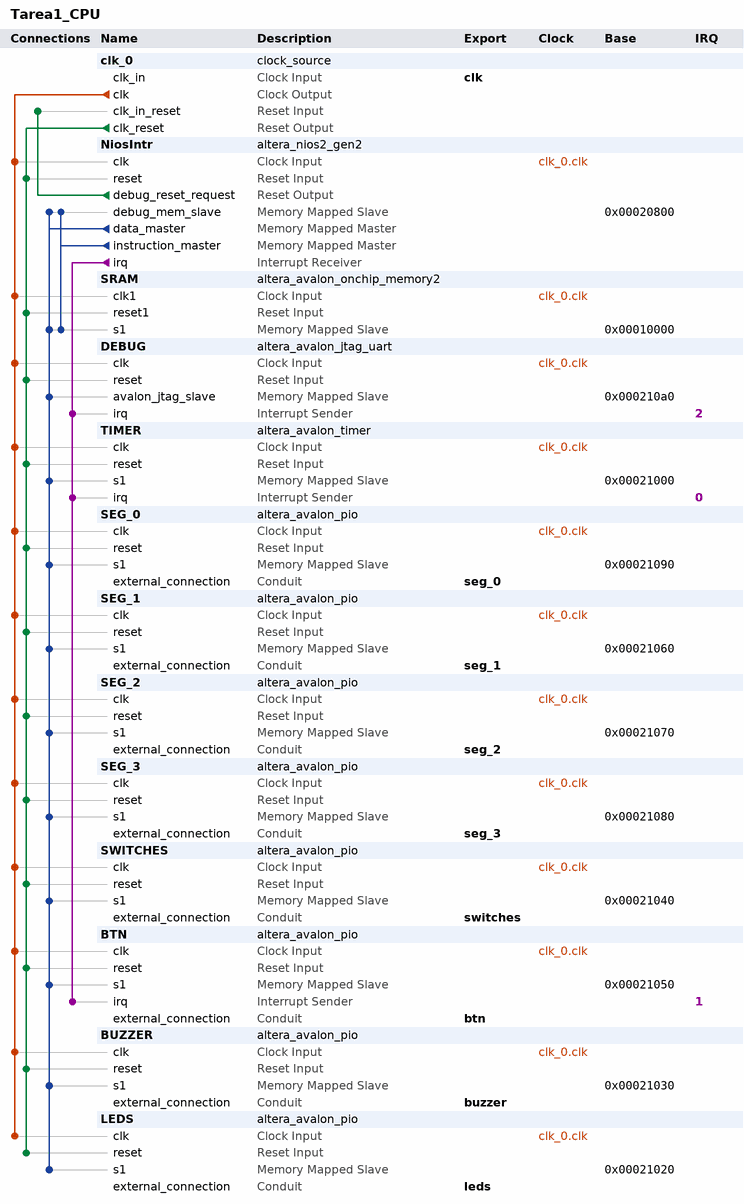
[diagram p0: system contents]
# Platform Designer (Qsys) system Tarea1_CPU, Cyclone V 5CSEMA5F31C6
# Parameters at their usual value, and those the tool derives, are not listed.
package require -exact qsys 18.1
create_system Tarea1_CPU
set_project_property DEVICE_FAMILY {Cyclone V}
set_project_property DEVICE 5CSEMA5F31C6

add_instance clk_0 clock_source 18.1
set_instance_parameter_value clk_0 clockFrequency 50000000

add_instance NiosIntr altera_nios2_gen2 18.1
set_instance_parameter_value NiosIntr dcache_size 2048
set_instance_parameter_value NiosIntr exceptionSlave SRAM.s1
set_instance_parameter_value NiosIntr icache_size 4096
set_instance_parameter_value NiosIntr impl Fast
set_instance_parameter_value NiosIntr resetSlave SRAM.s1

add_instance SRAM altera_avalon_onchip_memory2 18.1
set_instance_parameter_value SRAM dataWidth 32
set_instance_parameter_value SRAM dualPort false
set_instance_parameter_value SRAM initMemContent true
set_instance_parameter_value SRAM initializationFileName onchip_mem.hex
set_instance_parameter_value SRAM memorySize 40960

add_instance DEBUG altera_avalon_jtag_uart 18.1
set_instance_parameter_value DEBUG simInteractiveOptions NO_INTERACTIVE_WINDOWS

add_instance TIMER altera_avalon_timer 18.1
set_instance_parameter_value TIMER period 500
set_instance_parameter_value TIMER periodUnits MSEC

add_instance SEG_0 altera_avalon_pio 18.1
set_instance_parameter_value SEG_0 direction Output
set_instance_parameter_value SEG_0 width 7

add_instance SEG_1 altera_avalon_pio 18.1
set_instance_parameter_value SEG_1 direction Output
set_instance_parameter_value SEG_1 width 7

add_instance SEG_2 altera_avalon_pio 18.1
set_instance_parameter_value SEG_2 direction Output
set_instance_parameter_value SEG_2 width 7

add_instance SEG_3 altera_avalon_pio 18.1
set_instance_parameter_value SEG_3 direction Output
set_instance_parameter_value SEG_3 width 7

add_instance SWITCHES altera_avalon_pio 18.1
set_instance_parameter_value SWITCHES captureEdge true
set_instance_parameter_value SWITCHES direction Input
set_instance_parameter_value SWITCHES width 4

add_instance BTN altera_avalon_pio 18.1
set_instance_parameter_value BTN captureEdge true
set_instance_parameter_value BTN direction Input
set_instance_parameter_value BTN edgeType FALLING
set_instance_parameter_value BTN generateIRQ true
set_instance_parameter_value BTN width 2

add_instance BUZZER altera_avalon_pio 18.1
set_instance_parameter_value BUZZER direction Output
set_instance_parameter_value BUZZER width 1

add_instance LEDS altera_avalon_pio 18.1
set_instance_parameter_value LEDS direction Output
set_instance_parameter_value LEDS width 5

# connections
add_connection clk_0.clk BTN.clk clock
add_connection clk_0.clk BUZZER.clk clock
add_connection clk_0.clk DEBUG.clk clock
add_connection clk_0.clk LEDS.clk clock
add_connection clk_0.clk NiosIntr.clk clock
add_connection clk_0.clk SEG_0.clk clock
add_connection clk_0.clk SEG_1.clk clock
add_connection clk_0.clk SEG_2.clk clock
add_connection clk_0.clk SEG_3.clk clock
add_connection clk_0.clk SRAM.clk1 clock
add_connection clk_0.clk SWITCHES.clk clock
add_connection clk_0.clk TIMER.clk clock
add_connection clk_0.clk_reset BTN.reset reset
add_connection clk_0.clk_reset BUZZER.reset reset
add_connection clk_0.clk_reset DEBUG.reset reset
add_connection clk_0.clk_reset LEDS.reset reset
add_connection clk_0.clk_reset NiosIntr.reset reset
add_connection clk_0.clk_reset SEG_0.reset reset
add_connection clk_0.clk_reset SEG_1.reset reset
add_connection clk_0.clk_reset SEG_2.reset reset
add_connection clk_0.clk_reset SEG_3.reset reset
add_connection clk_0.clk_reset SRAM.reset1 reset
add_connection clk_0.clk_reset SWITCHES.reset reset
add_connection clk_0.clk_reset TIMER.reset reset
add_connection NiosIntr.debug_reset_request clk_0.clk_in_reset reset
add_connection NiosIntr.data_master BTN.s1 avalon
set_connection_parameter_value NiosIntr.data_master/BTN.s1 baseAddress 0x00021050
add_connection NiosIntr.data_master BUZZER.s1 avalon
set_connection_parameter_value NiosIntr.data_master/BUZZER.s1 baseAddress 0x00021030
add_connection NiosIntr.data_master DEBUG.avalon_jtag_slave avalon
set_connection_parameter_value NiosIntr.data_master/DEBUG.avalon_jtag_slave baseAddress 0x000210a0
add_connection NiosIntr.data_master LEDS.s1 avalon
set_connection_parameter_value NiosIntr.data_master/LEDS.s1 baseAddress 0x00021020
add_connection NiosIntr.data_master NiosIntr.debug_mem_slave avalon
set_connection_parameter_value NiosIntr.data_master/NiosIntr.debug_mem_slave baseAddress 0x00020800
add_connection NiosIntr.data_master SEG_0.s1 avalon
set_connection_parameter_value NiosIntr.data_master/SEG_0.s1 baseAddress 0x00021090
add_connection NiosIntr.data_master SEG_1.s1 avalon
set_connection_parameter_value NiosIntr.data_master/SEG_1.s1 baseAddress 0x00021060
add_connection NiosIntr.data_master SEG_2.s1 avalon
set_connection_parameter_value NiosIntr.data_master/SEG_2.s1 baseAddress 0x00021070
add_connection NiosIntr.data_master SEG_3.s1 avalon
set_connection_parameter_value NiosIntr.data_master/SEG_3.s1 baseAddress 0x00021080
add_connection NiosIntr.data_master SRAM.s1 avalon
set_connection_parameter_value NiosIntr.data_master/SRAM.s1 baseAddress 0x00010000
add_connection NiosIntr.data_master SWITCHES.s1 avalon
set_connection_parameter_value NiosIntr.data_master/SWITCHES.s1 baseAddress 0x00021040
add_connection NiosIntr.data_master TIMER.s1 avalon
set_connection_parameter_value NiosIntr.data_master/TIMER.s1 baseAddress 0x00021000
add_connection NiosIntr.instruction_master NiosIntr.debug_mem_slave avalon
set_connection_parameter_value NiosIntr.instruction_master/NiosIntr.debug_mem_slave baseAddress 0x00020800
add_connection NiosIntr.instruction_master SRAM.s1 avalon
set_connection_parameter_value NiosIntr.instruction_master/SRAM.s1 baseAddress 0x00010000
add_connection NiosIntr.irq BTN.irq interrupt
set_connection_parameter_value NiosIntr.irq/BTN.irq irqNumber 1
add_connection NiosIntr.irq DEBUG.irq interrupt
set_connection_parameter_value NiosIntr.irq/DEBUG.irq irqNumber 2
add_connection NiosIntr.irq TIMER.irq interrupt
set_connection_parameter_value NiosIntr.irq/TIMER.irq irqNumber 0

# exported interfaces
add_interface btn conduit end
set_interface_property btn EXPORT_OF BTN.external_connection
add_interface buzzer conduit end
set_interface_property buzzer EXPORT_OF BUZZER.external_connection
add_interface clk clock sink
set_interface_property clk EXPORT_OF clk_0.clk_in
add_interface leds conduit end
set_interface_property leds EXPORT_OF LEDS.external_connection
add_interface seg_0 conduit end
set_interface_property seg_0 EXPORT_OF SEG_0.external_connection
add_interface seg_1 conduit end
set_interface_property seg_1 EXPORT_OF SEG_1.external_connection
add_interface seg_2 conduit end
set_interface_property seg_2 EXPORT_OF SEG_2.external_connection
add_interface seg_3 conduit end
set_interface_property seg_3 EXPORT_OF SEG_3.external_connection
add_interface switches conduit end
set_interface_property switches EXPORT_OF SWITCHES.external_connection

set_interconnect_requirement {$system} qsys_mm.clockCrossingAdapter HANDSHAKE
set_interconnect_requirement {$system} qsys_mm.enableEccProtection FALSE
set_interconnect_requirement {$system} qsys_mm.insertDefaultSlave FALSE
set_interconnect_requirement {$system} qsys_mm.maxAdditionalLatency 1

save_system Tarea1_CPU.qsys
